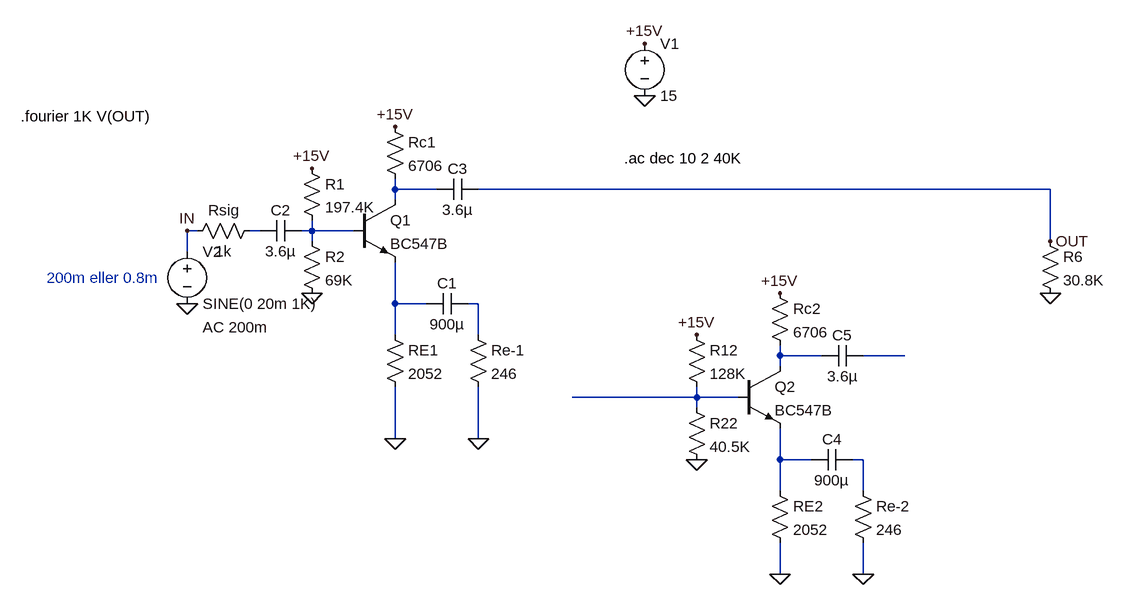
[diagram p0: schematic diagram.asc]
diagram.asc, the LTspice schematic file:
Version 4
SHEET 1 1276 680
WIRE 176 64 176 48
WIRE 240 64 176 64
WIRE 1184 64 304 64
WIRE 176 80 176 64
WIRE -128 128 -144 128
WIRE -32 128 -48 128
WIRE 48 128 48 112
WIRE 48 128 32 128
WIRE 112 128 48 128
WIRE 48 144 48 128
WIRE 1184 144 1184 64
WIRE -144 160 -144 128
WIRE 176 240 176 176
WIRE 224 240 176 240
WIRE 304 240 288 240
WIRE 176 288 176 240
WIRE 304 288 304 240
WIRE 768 320 768 304
WIRE 832 320 768 320
WIRE 960 320 896 320
WIRE 768 336 768 320
WIRE 640 384 640 368
WIRE 640 384 448 384
WIRE 704 384 640 384
WIRE 640 400 640 384
WIRE 176 448 176 368
WIRE 304 448 304 368
WIRE 768 480 768 432
WIRE 816 480 768 480
WIRE 896 480 880 480
WIRE 768 528 768 480
WIRE 896 528 896 480
WIRE 768 656 768 608
WIRE 896 656 896 608
FLAG 48 224 0
FLAG 304 448 0
FLAG 176 448 0
FLAG 48 32 +15V
FLAG 176 -32 +15V
FLAG 560 -160 +15V
FLAG 560 -80 0
FLAG -144 240 0
FLAG 1184 224 0
FLAG 1184 144 OUT
FLAG -144 128 IN
FLAG 640 480 0
FLAG 896 656 0
FLAG 768 656 0
FLAG 640 288 +15V
FLAG 768 224 +15V
SYMBOL res 32 16 R0
SYMATTR InstName R1
SYMATTR Value 197.4K
SYMBOL res 32 128 R0
SYMATTR InstName R2
SYMATTR Value 69K
SYMBOL res 160 272 R0
SYMATTR InstName RE1
SYMATTR Value 2052
SYMBOL res 288 272 R0
SYMATTR InstName Re-1
SYMATTR Value 246
SYMBOL res 160 -48 R0
SYMATTR InstName Rc1
SYMATTR Value 6706
SYMBOL npn 112 80 R0
SYMATTR InstName Q1
SYMATTR Value BC547B
SYMBOL cap 288 224 R90
WINDOW 0 0 32 VBottom 0
WINDOW 3 32 32 VTop 0
SYMATTR InstName C1
SYMATTR Value 900µ
SYMBOL voltage 560 -176 R0
WINDOW 123 0 0 Left 0
WINDOW 39 0 0 Left 0
SYMATTR InstName V1
SYMATTR Value 15
SYMBOL voltage -144 144 R0
WINDOW 123 24 132 Left 0
WINDOW 39 24 132 Left 0
SYMATTR Value2 AC 200m
SYMATTR InstName V2
SYMATTR Value SINE(0 20m 1K)
SYMBOL cap 32 112 R90
WINDOW 0 0 32 VBottom 0
WINDOW 3 32 32 VTop 0
SYMATTR InstName C2
SYMATTR Value 3.6µ
SYMBOL cap 304 48 R90
WINDOW 0 0 32 VBottom 0
WINDOW 3 32 32 VTop 0
SYMATTR InstName C3
SYMATTR Value 3.6µ
SYMBOL res 1168 128 R0
SYMATTR InstName R6
SYMATTR Value 30.8K
SYMBOL res -144 144 R270
WINDOW 0 32 56 VTop 0
WINDOW 3 0 56 VBottom 0
SYMATTR InstName Rsig
SYMATTR Value 1k
SYMBOL res 624 272 R0
SYMATTR InstName R12
SYMATTR Value 128K
SYMBOL res 624 384 R0
SYMATTR InstName R22
SYMATTR Value 40.5K
SYMBOL res 752 512 R0
SYMATTR InstName RE2
SYMATTR Value 2052
SYMBOL res 880 512 R0
SYMATTR InstName Re-2
SYMATTR Value 246
SYMBOL res 752 208 R0
SYMATTR InstName Rc2
SYMATTR Value 6706
SYMBOL npn 704 336 R0
SYMATTR InstName Q2
SYMATTR Value BC547B
SYMBOL cap 880 464 R90
WINDOW 0 0 32 VBottom 0
WINDOW 3 32 32 VTop 0
SYMATTR InstName C4
SYMATTR Value 900µ
SYMBOL cap 896 304 R90
WINDOW 0 0 32 VBottom 0
WINDOW 3 32 32 VTop 0
SYMATTR InstName C5
SYMATTR Value 3.6µ
TEXT 528 16 Left 0 !.ac dec 10 2 40K
TEXT -360 200 Left 0 ;200m eller 0.8m
TEXT -400 -48 Left 0 !.fourier 1K V(OUT)

The netlist it stands for:
* diagram.asc
R1 +15V N003 197.4K
R2 N003 0 69K
RE1 N004 0 2052
Re-1 N005 0 246
Rc1 +15V N001 6706
Q1 N001 N003 N004 0 BC547B
C1 N005 N004 900µ
V1 +15V 0 15
V2 IN 0 SINE(0 20m 1K) AC 200m
C2 N003 N002 3.6µ
C3 OUT N001 3.6µ
R6 OUT 0 30.8K
Rsig IN N002 1k
R12 +15V N008 128K
R22 N008 0 40.5K
RE2 N009 0 2052
Re-2 N010 0 246
Rc2 +15V N006 6706
Q2 N006 N008 N009 0 BC547B
C4 N010 N009 900µ
C5 N007 N006 3.6µ
.model NPN NPN
.model PNP PNP
.lib standard.bjt
.ac dec 10 2 40K
* 200m eller 0.8m
.fourier 1K V(OUT)
.backanno
.end